# EAGLE schematic drive itr2 (EAGLE 6.5.0)
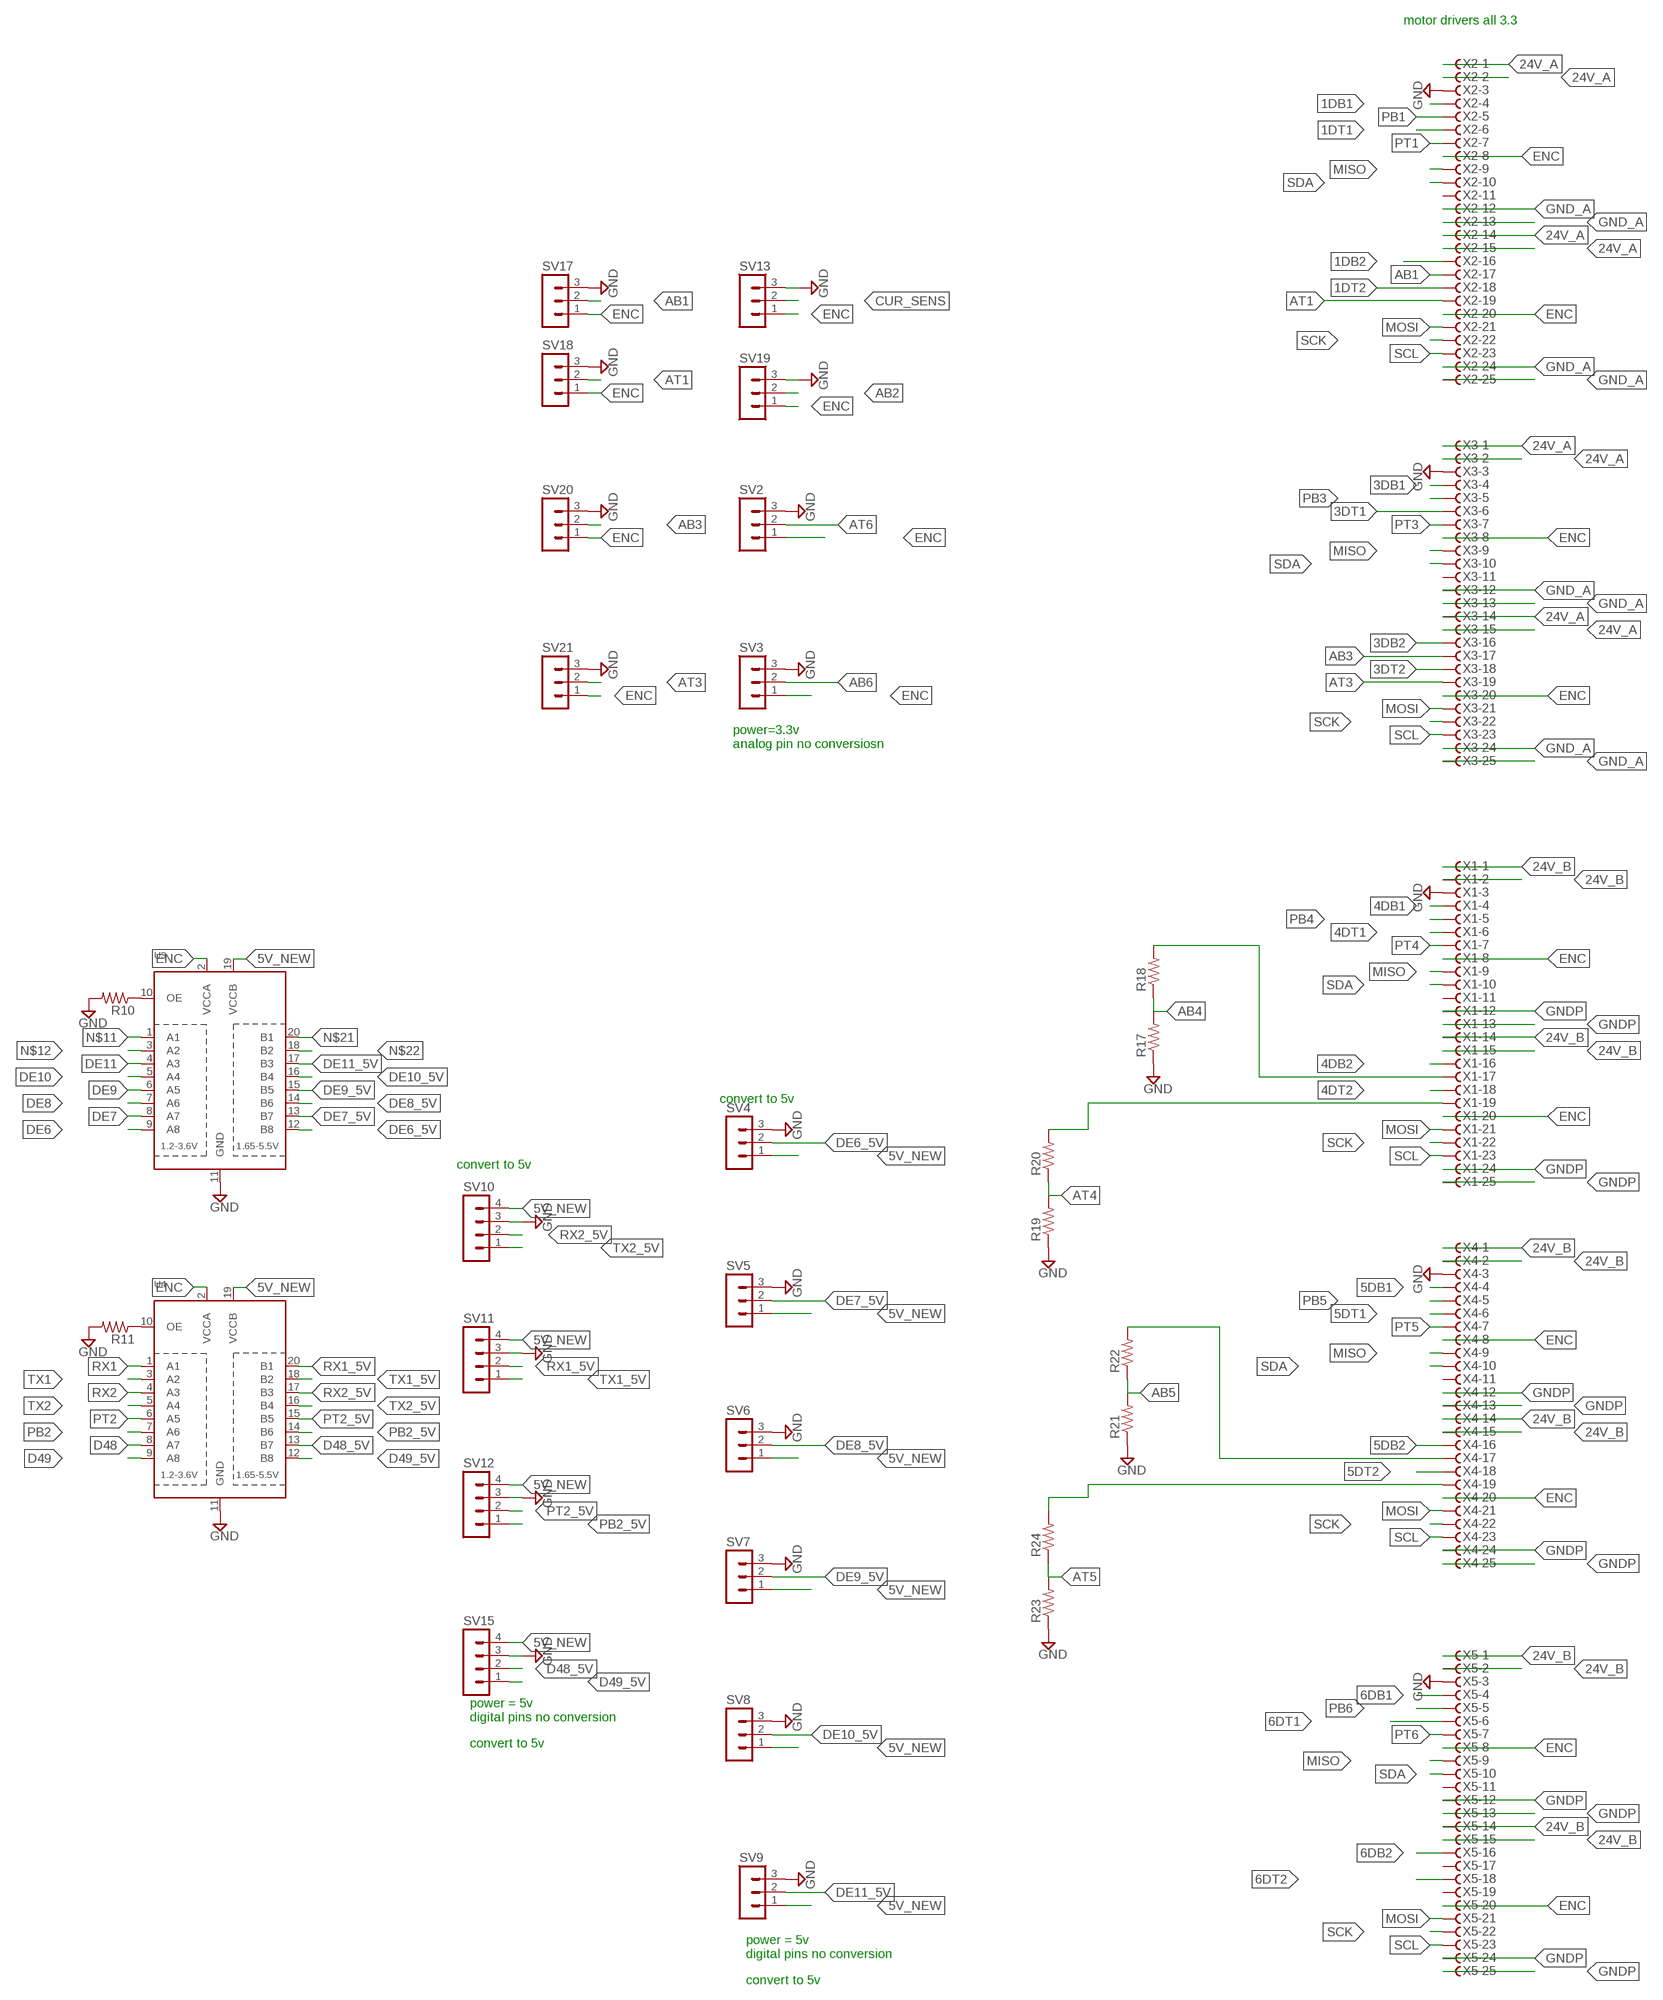
[diagram p0: schematic, sheet 1, part 1 of 2]
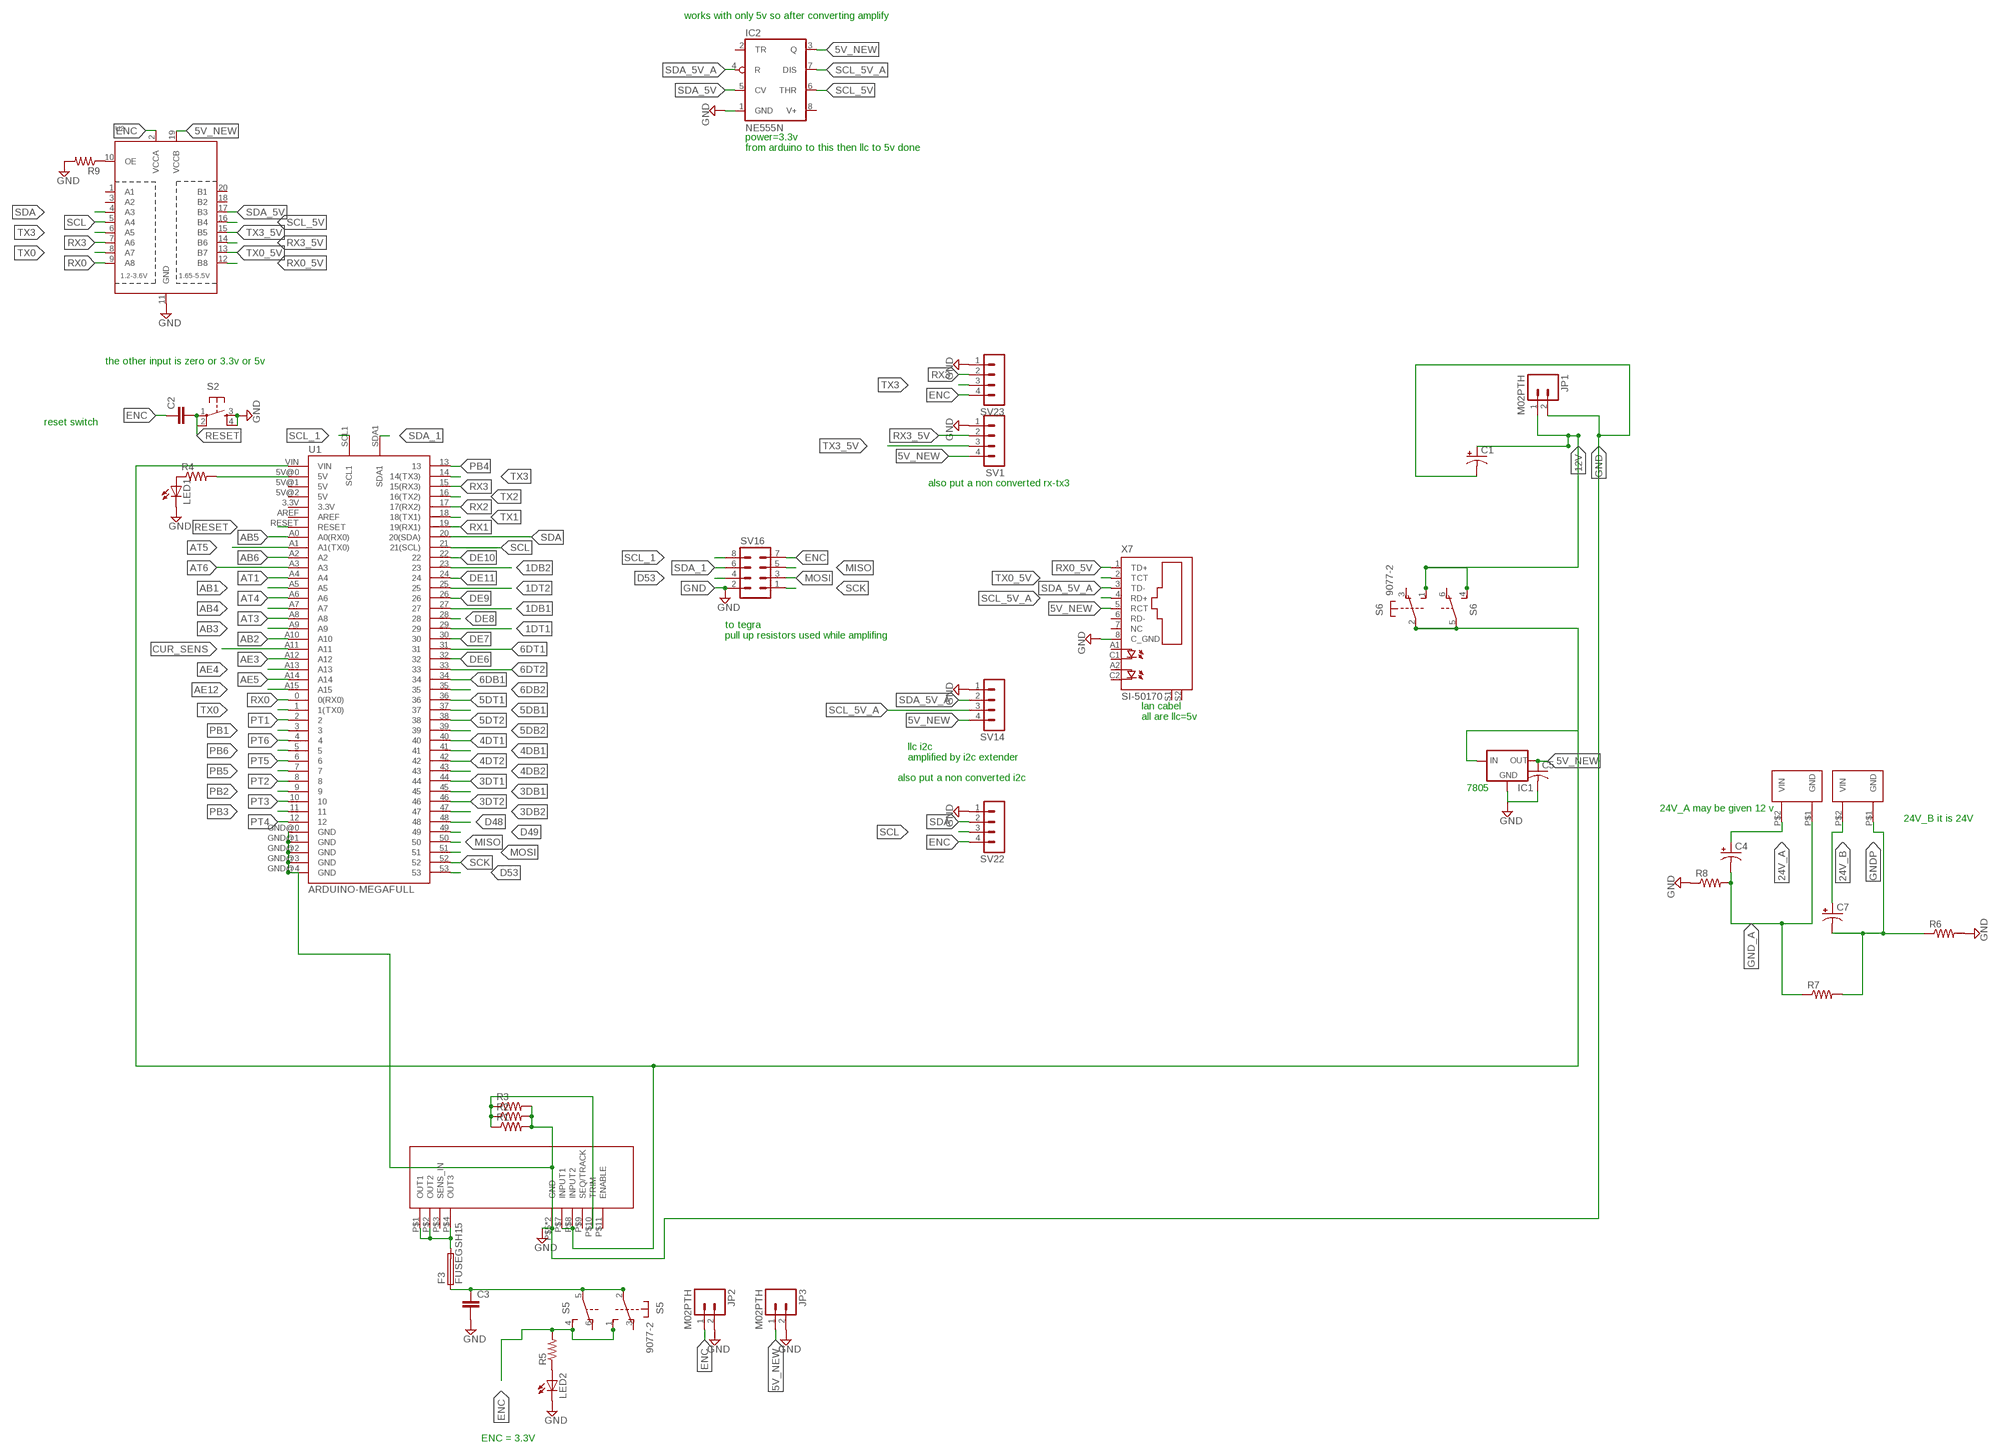
[diagram p1: schematic, sheet 1, part 2 of 2]

## Parts
C1  CPOL-USE2.5-5  [E2,5-5]
C2  C2,5-3  [C2.5-3]
C3  C2.5/2  [C2.5-2]
C4  CPOL-USE2.5-5  [E2,5-5]
C5  C-US025-030X050  [C025-030X050]
C7  CPOL-USE2.5-5  [E2,5-5]
F3  FUSEGSH15  GSH15  [GSH15]
IC1  V_REG_78XX-TO-220  [TO-220-ALT]
IC2  NE555N  [DIL08-ROUND]
JP1  M02PTH  [1X02]
JP2  M02PTH  [1X02]
JP3  M02PTH  [1X02]
LED1  LED3MM  [LED3MM]
LED2  LED3MM  [LED3MM]
R1  R-US_0207/10  [0207/10]
R2  R-US_0207/10  [0207/10]
R3  R-US_0207/10  [0207/10]
R4  R-US_0207/10  [0207/10]
R5  R-US_0207/10  [0207/10]
R6  R-US_0207/10  [0207/10]
R7  R-US_0207/10  [0207/10]
R8  R-US_0207/10  [0207/10]
R9  R-US_0207/10  [0207/10]
R10  R-US_0207/10  [0207/10]
R11  R-US_0207/10  [0207/10]
R17  R-US_0207/10  [0207/10]
R18  R-US_0207/10  [0207/10]
R19  R-US_0207/10  [0207/10]
R20  R-US_0207/10  [0207/10]
R21  R-US_0207/10  [0207/10]
R22  R-US_0207/10  [0207/10]
R23  R-US_0207/10  [0207/10]
R24  R-US_0207/10  [0207/10]
S2  TAC_SWITCHSMD  [TACTILE-SWITCH-SMD]
S5  9077-2  [9077-2]
S6  9077-2  [9077-2]
SV1  MA04-1  [MA04-1]
SV2  MA03-1  [MA03-1]
SV3  MA03-1  [MA03-1]
SV4  MA03-1  [MA03-1]
SV5  MA03-1  [MA03-1]
SV6  MA03-1  [MA03-1]
SV7  MA03-1  [MA03-1]
SV8  MA03-1  [MA03-1]
SV9  MA03-1  [MA03-1]
SV10  MA04-1  [MA04-1]
SV11  MA04-1  [MA04-1]
SV12  MA04-1  [MA04-1]
SV13  MA03-1  [MA03-1]
SV14  MA04-1  [MA04-1]
SV15  MA04-1  [MA04-1]
SV16  MA04-2  [MA04-2]
SV17  MA03-1  [MA03-1]
SV18  MA03-1  [MA03-1]
SV19  MA03-1  [MA03-1]
SV20  MA03-1  [MA03-1]
SV21  MA03-1  [MA03-1]
SV22  MA04-1  [MA04-1]
SV23  MA04-1  [MA04-1]
U1  ARDUINO-MEGAFULL  [ARDUINO_MEGA]
U2  TXB0108PWR  [TSSOP20]
U3  TXB0108PWR  [TSSOP20]
U4  TXB0108PWR  [TSSOP20]
U$7  VREG-MURATA  [VREG]
U$8  POW_HOLE  [POW_HOLE]
U$9  POW_HOLE  [POW_HOLE]
X1  F25HPS  [F25HP]
X2  F25HPS  [F25HP]
X3  F25HPS  [F25HP]
X4  F25HPS  [F25HP]
X5  F25HPS  [F25HP]
X7  SI-50170  [SI-50170]

## Nets
1DB1: U1.27 X2.4
1DB2: U1.23 X2.16
1DT1: U1.29 X2.6
1DT2: U1.25 X2.18
3DB1: U1.45 X3.4
3DB2: U1.47 X3.16
3DT1: U1.44 X3.6
3DT2: U1.46 X3.18
4DB1: U1.41 X1.4
4DB2: U1.43 X1.16
4DT1: U1.40 X1.6
4DT2: U1.42 X1.18
5DB1: U1.37 X4.4
5DB2: U1.39 X4.16
5DT1: U1.36 X4.6
5DT2: U1.38 X4.18
5V_NEW: C5.1 IC1.OUT IC2.3(Q) JP3.1 SV1.4 SV4.1 SV5.1 SV6.1 SV7.1 SV8.1 SV9.1 SV10.4 SV11.4 SV12.4 SV14.4 SV15.4 U2.19(VCCB) U3.19(VCCB) U4.19(VCCB) X7.5(RCT)
6DB1: U1.34 X5.4
6DB2: U1.35 X5.16
6DT1: U1.31 X5.6
6DT2: U1.33 X5.18
12V: C1.+ JP1.1 S6.1(1:S) S6.4(2:S)
24V_A: C4.+ U$9.P$2(VIN) X2.1 X2.2 X2.14 X2.15 X3.1 X3.2 X3.14 X3.15
24V_B: C7.+ U$8.P$2(VIN) X1.1 X1.2 X1.14 X1.15 X4.1 X4.2 X4.14 X4.15 X5.1 X5.2 X5.14 X5.15
AB1: SV17.2 U1.A5 X2.17
AB2: SV19.2 U1.A10
AB3: SV20.2 U1.A9 X3.17
AB4: R17.2 R18.1 U1.A7
AB5: R21.2 R22.1 U1.A0(A0(RX0))
AB6: SV3.2 U1.A2
AE3: U1.A12
AE4: U1.A13
AE5: U1.A14
AE12: U1.A15
AT1: SV18.2 U1.A4
AT3: SV21.2 U1.A8 X3.19
AT4: R19.2 R20.1 U1.A6
AT5: R23.2 R24.1 U1.A1(A1(TX0))
AT6: SV2.2 U1.A3
CONN: C3.1 F3.1 S5.2(1:P) S5.5(2:P)
CUR_SENS: SV13.2 U1.A11
D48: U1.48 U4.8(A7)
D48_5V: SV15.2 U4.13(B7)
D49: U1.49 U4.9(A8)
D49_5V: SV15.1 U4.12(B8)
D53: SV16.4 U1.53
DE6: U1.32 U3.9(A8)
DE6_5V: SV4.2 U3.12(B8)
DE7: U1.30 U3.8(A7)
DE7_5V: SV5.2 U3.13(B7)
DE8: U1.28 U3.7(A6)
DE8_5V: SV6.2 U3.14(B6)
DE9: U1.26 U3.6(A5)
DE9_5V: SV7.2 U3.15(B5)
DE10: U1.22 U3.5(A4)
DE10_5V: SV8.2 U3.16(B4)
DE11: U1.24 U3.4(A3)
DE11_5V: SV9.2 U3.17(B3)
ENC: C2.1 JP2.1 R5.2 S5.1(1:S) S5.4(2:S) SV2.1 SV3.1 SV13.1 SV16.7 SV17.1 SV18.1 SV19.1 SV20.1 SV21.1 SV22.4 SV23.4 U2.2(VCCA) U3.2(VCCA) U4.2(VCCA) X1.8 X1.20 X2.8 X2.20 X3.8 X3.20 X4.8 X4.20 X5.8 X5.20
GND: C1.- C3.2 C5.2 IC1.GND IC2.1(GND) JP1.2 JP2.2 JP3.2 LED1.K(C) LED2.K(C) R1.2 R2.2 R3.2 R6.2 R8.1 R9.2 R10.2 R11.2 R17.1 R19.1 R21.1 R23.1 S2.3 S2.4 SV1.1 SV2.3 SV3.3 SV4.3 SV5.3 SV6.3 SV7.3 SV8.3 SV9.3 SV10.3 SV11.3 SV12.3 SV13.3 SV14.1 SV15.3 SV16.2 SV17.3 SV18.3 SV19.3 SV20.3 SV21.3 SV22.1 SV23.1 U1.GND@0(GND) U1.GND@1(GND) U1.GND@2(GND) U1.GND@3(GND) U1.GND@4(GND) U2.11(GND) U3.11(GND) U4.11(GND) U$7.P$5(GND) U$7.P$6(GND) X1.3 X2.3 X3.3 X4.3 X5.3 X7.8(C_GND)
GND_A: C4.- R7.1 R8.2 U$9.P$1(GND) X2.12 X2.13 X2.24 X2.25 X3.12 X3.13 X3.24 X3.25
GNDP: C7.- R6.1 R7.2 U$8.P$1(GND) X1.12 X1.13 X1.24 X1.25 X4.12 X4.13 X4.24 X4.25 X5.12 X5.13 X5.24 X5.25
MISO: SV16.5 U1.50 X1.9 X2.9 X3.9 X4.9 X5.9
MOSI: SV16.3 U1.51 X1.21 X2.21 X3.21 X4.21 X5.21
N$1: R9.1 U2.10(OE)
N$2: R10.1 U3.10(OE)
N$3: R11.1 U4.10(OE)
N$7: LED2.A R5.1
N$8: LED1.A R4.1
N$9: R4.2 U1.5V@0(5V)
N$11: U3.1(A1)
N$12: U3.3(A2)
N$15: F3.2 U$7.P$1(OUT1) U$7.P$2(OUT2) U$7.P$4(OUT3)
N$16: IC1.IN S6.2(1:P) S6.5(2:P) U1.VIN U$7.P$7(INPUT1) U$7.P$8(INPUT2)
N$21: U3.20(B1)
N$22: U3.18(B2)
N$25: R18.2 X1.17
N$26: R20.2 X1.19
N$27: R22.2 X4.17
N$28: R24.2 X4.19
N$31: R1.1 R2.1 R3.1 U$7.P$10(TRIM)
PB1: U1.3 X2.5
PB2: U1.9 U4.7(A6)
PB2_5V: SV12.1 U4.14(B6)
PB3: U1.11 X3.5
PB4: U1.13 X1.5
PB5: U1.7 X4.5
PB6: U1.5 X5.5
PT1: U1.2 X2.7
PT2: U1.8 U4.6(A5)
PT2_5V: SV12.2 U4.15(B5)
PT3: U1.10 X3.7
PT4: U1.12 X1.7
PT5: U1.6 X4.7
PT6: U1.4 X5.7
RESET: C2.2 S2.1 S2.2 U1.RESET
RX0: U1.0(0(RX0)) U2.9(A8)
RX0_5V: U2.12(B8) X7.1(TD+)
RX1: U1.19(19(RX1)) U4.1(A1)
RX1_5V: SV11.2 U4.20(B1)
RX2: U1.17(17(RX2)) U4.4(A3)
RX2_5V: SV10.2 U4.17(B3)
RX3: SV23.2 U1.15(15(RX3)) U2.7(A6)
RX3_5V: SV1.2 U2.14(B6)
SCK: SV16.1 U1.52 X1.22 X2.22 X3.22 X4.22 X5.22
SCL: SV22.3 U1.21(21(SCL)) U2.5(A4) X1.23 X2.23 X3.23 X4.23 X5.23
SCL_1: SV16.8 U1.SCL1
SCL_5V: IC2.6(THR) U2.16(B4)
SCL_5V_A: IC2.7(DIS) SV14.3 X7.4(RD+)
SDA: SV22.2 U1.20(20(SDA)) U2.4(A3) X1.10 X2.10 X3.10 X4.10 X5.10
SDA_1: SV16.6 U1.SDA1
SDA_5V: IC2.5(CV) U2.17(B3)
SDA_5V_A: IC2.4(R) SV14.2 X7.3(TD-)
TX0: U1.1(1(TX0)) U2.8(A7)
TX0_5V: U2.13(B7) X7.2(TCT)
TX1: U1.18(18(TX1)) U4.3(A2)
TX1_5V: SV11.1 U4.18(B2)
TX2: U1.16(16(TX2)) U4.5(A4)
TX2_5V: SV10.1 U4.16(B4)
TX3: SV23.3 U1.14(14(TX3)) U2.6(A5)
TX3_5V: SV1.3 U2.15(B5)
Unconnected: IC2.2(TR) S5.3(1:O) S5.6(2:O) S6.3(1:O) S6.6(2:O) U1.3.3V U1.5V@1(5V) U1.5V@2(5V) U1.AREF U2.1(A1) U2.3(A2) U2.18(B2) U2.20(B1) U$7.P$3(SENS_IN) U$7.P$9(SEQ/TRACK) U$7.P$11(ENABLE) X1.11 X2.11 X2.19 X3.11 X4.11 X5.11 X5.17 X5.19 X7.6(RD-) X7.7(NC) X7.A1(A) X7.A2(A1) X7.C1(C) X7.C2(C1) X7.S1 X7.S2

## Notes on the sheet
- motor drivers all 3.3
- works with only 5v so after converting amplify
- power=3.3v
  from arduino to this then llc to 5v done
- the other input is zero or 3.3v or 5v
- reset switch
- power=3.3v
  analog pin no conversiosn
- also put a non converted rx-tx3
- to tegra
  pull up resistors used while amplifing
- lan cabel
  all are llc=5v
- convert to 5v
- llc i2c
  amplified by i2c extender
- convert to 5v | also put a non converted i2c
- 7805
- 24V_A may be given 12 v
- 24V_B it is 24V
- power = 5v
  digital pins no conversion
- convert to 5v
- power = 5v
  digital pins no conversion
- convert to 5v
- ENC = 3.3V

## Power pins joined to a net without a drawn wire
V+: IC2.8(V+)

## Library data of the parts
C1 C4 C7 = adafruit:CPOL-US: POLARIZED CAPACITOR, American symbol
C2 C3 = capacitor-wima:C: CAPACITOR naming: grid - package width
C5 = adafruit:C-US: CAPACITOR, American symbol
F3 = fuse_modified:GSH15: FUSE HOLDER grid 15mm, 19649 Wickmann; MPN: 64900001039; OC_FARNELL: 1271673; OC_NEWARK: 02P0318
IC1 = SparkFun-PowerIC:V_REG_78XX: Voltage Regulator Standard 7805 5V regulator. IGO (Input Ground Output). Spark Fun Electronics SKU : COM-00107
IC2 = adafruit:*555: TIMER Changed DIP package to have round (not oval) pin pads http://www.ladyada.net/library/pcb/eaglelibrary.html
JP1-JP3 = SparkFun-Connectors:M02: Standard 2-pin 0.1" header. Use with - straight break away headers ( PRT-00116) - right angle break away headers (PRT-00553) - swiss pins (PRT-00743) - machine pins (PRT-00117) - female headers (PRT-00115) Molex polarized connector foot print use with: PRT-08233 with associated crimp pins and housings. 2.54_SCREWTERM for use with PRT-10571. 3.5mm Screw Terminal footprints for PRT-08084 5mm Screw Terminal footprints for use with PRT-08432
LED1 LED2 = led:LED: LED OSRAM: - CHIPLED LG R971, LG N971, LY N971, LG Q971, LY Q971, LO R971, LY R971 LH N974, LH R974 LS Q976, LO Q976, LY Q976 LO Q996 - Hyper CHIPLED LW Q18S LB Q993, LB Q99A, LB R99A - SideLED LS A670, LO A670, LY A670, LG A670, LP A670 LB A673, LV A673, LT A673, LW A673 LH A674 LY A675 LS A676, LA A676, LO A676, LY A676, LW A676 LS A679, LY A679, LG A679 - Hyper Micro SIDELED® LS Y876, LA Y876, LO Y876, LY Y876 LT Y87S - SmartLED LW L88C, LW L88S LB L89C, LB L89S, LG L890 LS L89K, LO L89K, LY L89K LS L896, LA L896, LO L896, LY L896 - TOPLED LS T670, LO T670, LY T670, LG T670, LP T670 LSG T670, LSP T670, LSY T670, LOP T670, LYG T670 LG T671, LOG T671, LSG T671 LB T673, LV T673, LT T673, LW T673 LH T674 LS T676, LA T676, LO T676, LY T676, LB T676, LH T676, LSB T676, LW T676 LB T67C, LV T67C, LT T67C, LS T67K, LO T67K, LY T67K, LW E67C LS E67B, LA E67B, LO E67B, LY E67B, LB E67C, LV E67C, LT E67C LW T67C LS T679, LY T679, LG T679 LS T770, LO T770, LY T770, LG T770, LP T770 LB T773, LV T773, LT T773, LW T773 LH T774 LS E675, LA E675, LY E675, LS T675 LS T776, LA T776, LO T776, LY T776, LB T776 LHGB T686 LT T68C, LB T68C - Hyper Mini TOPLED® LB M676 - Mini TOPLED Santana® LG M470 LS M47K, LO M47K, LY M47K Source: http://www.osram.convergy.de LUXEON: - LUMILED® LXK2-PW12-R00, LXK2-PW12-S00, LXK2-PW14-U00, LXK2-PW14-V00 LXK2-PM12-R00, LXK2-PM12-S00, LXK2-PM14-U00 LXK2-PE12-Q00, LXK2-PE12-R00, LXK2-PE12-S00, LXK2-PE14-T00, LXK2-PE14-U00 LXK2-PB12-K00, LXK2-PB12-L00, LXK2-PB12-M00, LXK2-PB14-N00, LXK2-PB14-P00, LXK2-PB14-Q00 LXK2-PR12-L00, LXK2-PR12-M00, LXK2-PR14-Q00, LXK2-PR14-R00 LXK2-PD12-Q00, LXK2-PD12-R00, LXK2-PD12-S00 LXK2-PH12-R00, LXK2-PH12-S00 LXK2-PL12-P00, LXK2-PL12-Q00, LXK2-PL12-R00 Source: www.luxeon.com KINGBRIGHT: KA-3528ASYC Source: www.kingbright.com
R1-R11 R17-R24 = adafruit:R-US_: RESISTOR, American symbol
S2 = SparkFun-Electromechanical:TAC_SWITCH: Momentary Switch Button commonly used for reset or general input. Spark Fun Electronics SKU : COM-00097 SMT- SWCH-08247
S5 S6 = switch-misc:9077-2: MARQUARDT SWITCH 9077.0200 Distributor: Buerklin <https://www.buerklin.com/default.asp?event=ShowArtikel%2812G2822%29&l=d&jump=ArtNr_12G2822>
SV1 SV10-SV12 SV14 SV15 SV22 SV23 = con-lstb:MA04-1: PIN HEADER; OC_FARNELL: unknown; OC_NEWARK: unknown
SV2-SV9 SV13 SV17-SV21 = con-lstb:MA03-1: PIN HEADER; OC_FARNELL: unknown; OC_NEWARK: unknown
SV16 = con-lstb:MA04-2: PIN HEADER; OC_FARNELL: unknown; OC_NEWARK: unknown
U1 = aurdino-mega_edited:ARDUINO-MEGA: Arduino Mega board footprint
U2-U4 = adafruit:TXB0108PWR: 8-Bit Bi-Directional Level Shifter 1.2V-3.6V (VCCA) to 1.65V-5.5V (VCCB) bi-directional level shifter with auto direction sensing. Max data rate - VCCA 1.8V: 20Mbps (50ns), VCCA 3.3V: 100Mbps (10ns) Digikey: 296-21527-1-ND
U$7 = VREG-MUR:VREG-MURATA
U$8 U$9 = POW_HOLE:POW_HOLE
X1-X5 = con-subd:F25HPS: SUB-D; OC_FARNELL: unknown; OC_NEWARK: unknown
X7 = con-stewart:SI-50170: Ethernet Connector MagJack (R) Source: www.stewartconnector.com .. si-50170.pdf; OC_FARNELL: unknown; OC_NEWARK: unknown